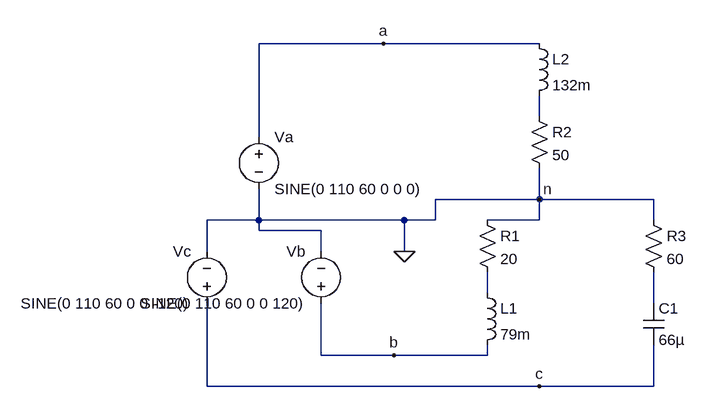
[diagram p0: schematic Lab 4 - neutrro.asc]
Lab 4 - neutrro.asc, the LTspice schematic file:
Version 4.1
SHEET 1 1036 680
WIRE 192 -96 0 -96
WIRE 432 -96 192 -96
WIRE 432 16 432 -16
WIRE 0 48 0 -96
WIRE 432 144 432 96
WIRE 432 144 272 144
WIRE 608 144 432 144
WIRE 0 176 0 128
WIRE 0 176 -80 176
WIRE 224 176 0 176
WIRE 272 176 272 144
WIRE 272 176 224 176
WIRE 432 176 432 144
WIRE 432 176 352 176
WIRE 608 176 608 144
WIRE 0 192 0 176
WIRE 96 192 0 192
WIRE -80 224 -80 176
WIRE 96 224 96 192
WIRE 224 224 224 176
WIRE 352 288 352 256
WIRE 608 304 608 256
WIRE 96 384 96 304
WIRE 208 384 96 384
WIRE 352 384 352 368
WIRE 352 384 208 384
WIRE -80 432 -80 304
WIRE 432 432 -80 432
WIRE 608 432 608 368
WIRE 608 432 432 432
FLAG 224 224 0
FLAG 192 -96 a
FLAG 432 144 n
FLAG 208 384 b
FLAG 432 432 c
SYMBOL voltage 0 32 R0
WINDOW 123 0 0 Left 0
WINDOW 39 0 0 Left 0
SYMATTR InstName Va
SYMATTR Value SINE(0 110 60 0 0 0)
SYMBOL voltage 96 320 R180
WINDOW 0 24 96 Left 2
WINDOW 3 24 16 Left 2
WINDOW 123 0 0 Left 0
WINDOW 39 0 0 Left 0
SYMATTR InstName Vb
SYMATTR Value SINE(0 110 60 0 0 120)
SYMBOL voltage -80 320 R180
WINDOW 0 24 96 Left 2
WINDOW 3 24 16 Left 2
WINDOW 123 0 0 Left 0
WINDOW 39 0 0 Left 0
SYMATTR InstName Vc
SYMATTR Value SINE(0 110 60 0 0 -120)
SYMBOL res 336 160 R0
SYMATTR InstName R1
SYMATTR Value 20
SYMBOL ind 336 272 R0
SYMATTR InstName L1
SYMATTR Value 79m
SYMBOL res 416 0 R0
SYMATTR InstName R2
SYMATTR Value 50
SYMBOL ind 416 -112 R0
SYMATTR InstName L2
SYMATTR Value 132m
SYMBOL res 592 160 R0
SYMATTR InstName R3
SYMATTR Value 60
SYMBOL cap 592 304 R0
SYMATTR InstName C1
SYMATTR Value 66µ

The netlist it stands for:
* Lab 4 - neutrro.asc
Va a 0 SINE(0 110 60 0 0 0)
Vb b 0 SINE(0 110 60 0 0 120)
Vc c 0 SINE(0 110 60 0 0 -120)
R1 0 N002 20
L1 N002 b 79m
R2 N001 0 50
L2 a N001 132m
R3 0 N003 60
C1 N003 c 66µ
.backanno
.end